# EAGLE schematic Arduino_clone (EAGLE 7.5.0)
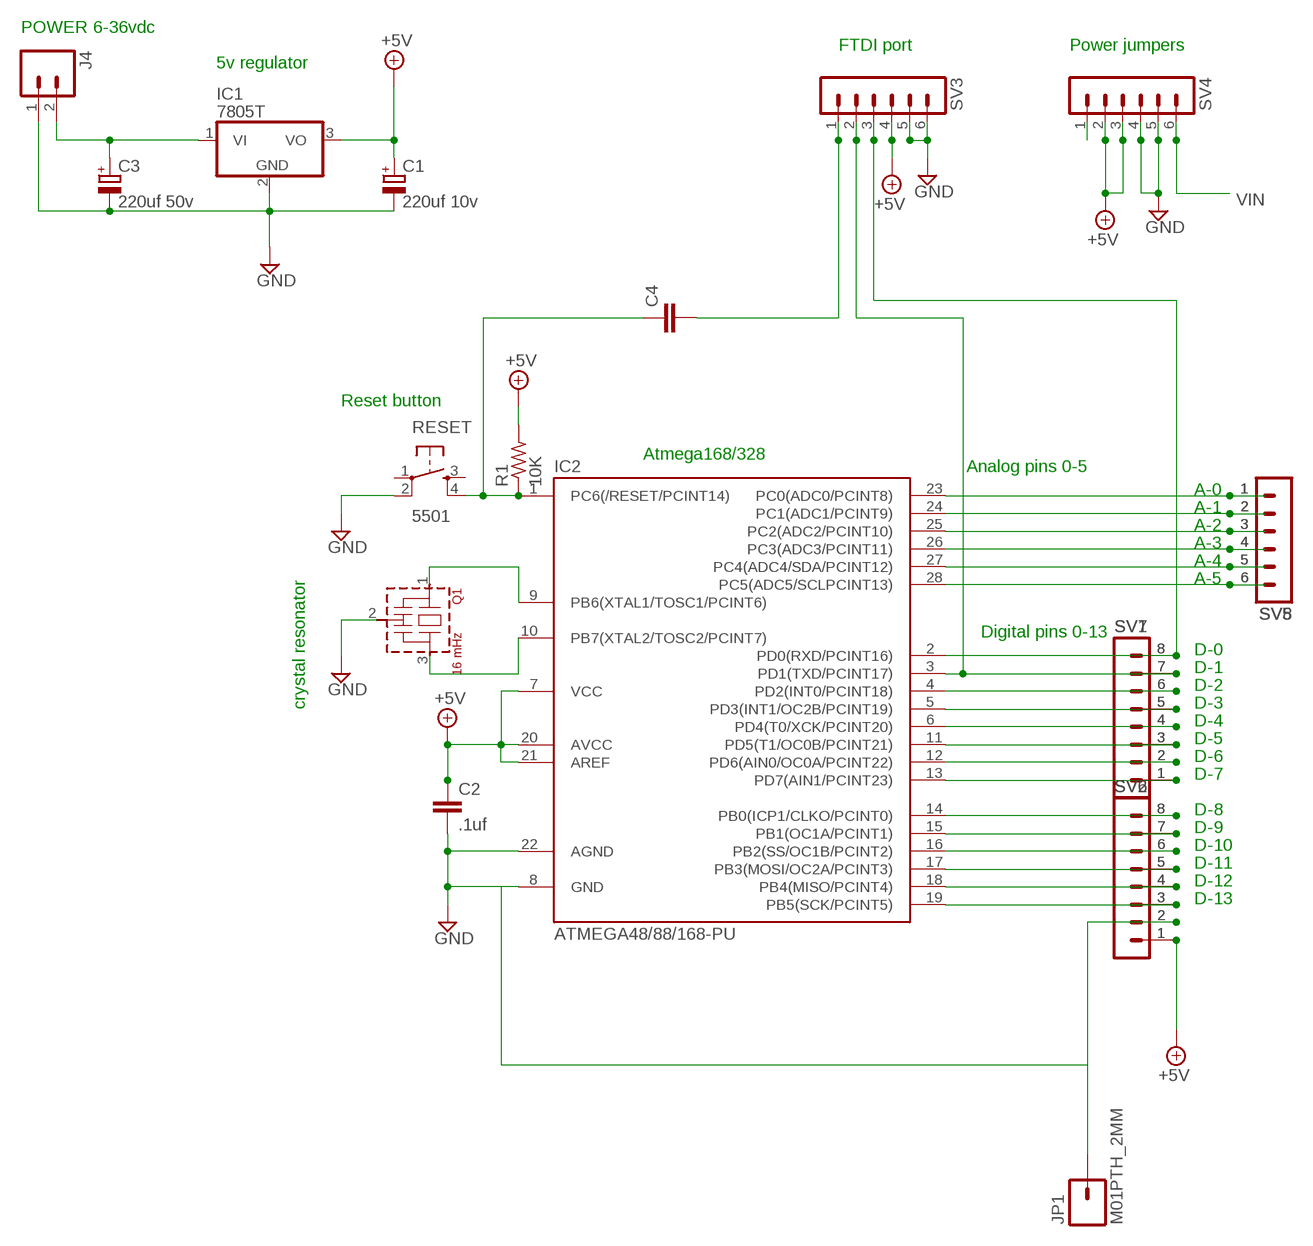
[diagram p0: schematic, sheet 1]

## Parts
C1  220uf 10v  CPOL-EUE2.5-6  [E2,5-6]
C2  .1uf  C-EU050-024X044  [C050-024X044]
C3  220uf 50v  CPOL-EUE2.5-6  [E2,5-6]
C4  C-EU075-032X103  [C075-032X103]
IC1  7805T  [TO220H]
IC2  ATMEGA48/88/168-PU  [DIL28-3]
J4  M02LOCK  [1X02_LOCK]
JP1  M01PTH_2MM  [1X01_2MM]
Q1  16 mHz  CSTLS_X  [CSTLS_X]
R1  10K  R-US_0204/5  [0204/5]
RESET  5501  TAC_SWITCHPTH  [TACTILE-PTH]
SV1  MA08-1  [MA08-1]
SV2  MA08-1  [MA08-1]
SV3  MA06-1  [MA06-1]
SV4  MA06-1  [MA06-1]
SV5  MA06-1  [MA06-1]
SV6  MA08-1  [MA08-1]
SV7  MA08-1  [MA08-1]
SV8  MA06-1  [MA06-1]

## Nets
+5V: C1.+ C2.1 IC1.3(VO) IC2.7(VCC) IC2.20(AVCC) IC2.21(AREF) R1.2 SV2.1 SV3.4 SV4.2 SV4.3 SV6.1
A0: IC2.23(PC0(ADC0/PCINT8)) SV5.1 SV8.1
A1: IC2.24(PC1(ADC1/PCINT9)) SV5.2 SV8.2
A2: IC2.25(PC2(ADC2/PCINT10)) SV5.3 SV8.3
A3: IC2.26(PC3(ADC3/PCINT11)) SV5.4 SV8.4
A4: IC2.27(PC4(ADC4/SDA/PCINT12)) SV5.5 SV8.5
A5: IC2.28(PC5(ADC5/SCLPCINT13)) SV5.6 SV8.6
D0: IC2.2(PD0(RXD/PCINT16)) SV1.8 SV3.3 SV7.8
D1: IC2.3(PD1(TXD/PCINT17)) SV1.7 SV3.2 SV7.7
D2: IC2.4(PD2(INT0/PCINT18)) SV1.6 SV7.6
D3: IC2.5(PD3(INT1/OC2B/PCINT19)) SV1.5 SV7.5
D4: IC2.6(PD4(T0/XCK/PCINT20)) SV1.4 SV7.4
D5: IC2.11(PD5(T1/OC0B/PCINT21)) SV1.3 SV7.3
D6: IC2.12(PD6(AIN0/OC0A/PCINT22)) SV1.2 SV7.2
D7: IC2.13(PD7(AIN1/PCINT23)) SV1.1 SV7.1
D8: IC2.14(PB0(ICP1/CLKO/PCINT0)) SV2.8 SV6.8
D9: IC2.15(PB1(OC1A/PCINT1)) SV2.7 SV6.7
D10: IC2.16(PB2(SS/OC1B/PCINT2)) SV2.6 SV6.6
D11: IC2.17(PB3(MOSI/OC2A/PCINT3)) SV2.5 SV6.5
D12: IC2.18(PB4(MISO/PCINT4)) SV2.4 SV6.4
D13: IC2.19(PB5(SCK/PCINT5)) SV2.3 SV6.3
GND: C1.- C2.2 C3.- IC1.2(GND) IC2.8(GND) IC2.22(AGND) J4.1 JP1.1 Q1.2(VSS) RESET.2 SV2.2 SV3.5 SV3.6 SV4.4 SV4.5 SV6.2
N$1: C4.2 SV3.1
N$3: IC2.10(PB7(XTAL2/TOSC2/PCINT7)) Q1.3
N$5: IC2.9(PB6(XTAL1/TOSC1/PCINT6)) Q1.1
N$6: SV4.1
RESET: C4.1 IC2.1(PC6(/RESET/PCINT14)) R1.1 RESET.4
VIN: C3.+ IC1.1(VI) J4.2 SV4.6
Unconnected: RESET.1 RESET.3

## Notes on the sheet
- POWER 6-36vdc
- FTDI port | Power jumpers
- 5v regulator
- Reset button
- Atmega168/328 | Analog pins 0-5
- A-0
- A-1
- A-2
- A-3
- A-4
- A-5
- Digital pins 0-13
- D-0
- D-1
- D-2
- crystal resonator | D-3
- D-4
- D-5
- D-6
- D-7
- D-8
- D-9
- D-10
- D-11
- D-12
- D-13

## Library data of the parts
C1 C3 = rcl:CPOL-EU: POLARIZED CAPACITOR, European symbol
C2 C4 = rcl:C-EU: CAPACITOR, European symbol
IC1 = linear:78*: Positive VOLTAGE REGULATOR Source: http://cache.national.com/ds/LM/LM78L05.pdf http://www.fairchildsemi.com/ds/LM/LM7805.pdf
IC2 = atmega8:ATMEGA48/88/168-PU
J4 = SparkFun:M02: Header 2 Standard 2-pin 0.1" header. Use with straight break away headers (SKU : PRT-00116), right angle break away headers (PRT-00553), swiss pins (PRT-00743), machine pins (PRT-00117), and female headers (PRT-00115). Molex polarized connector foot print use with SKU : PRT-08233 with associated crimp pins and housings.
JP1 = SparkFun:M01: Header 1 Standard 1-pin 0.1" header. Use with straight break away headers (SKU : PRT-00116), right angle break away headers (PRT-00553), swiss pins (PRT-00743), machine pins (PRT-00117), and female headers (PRT-00115).
Q1 = murata-resonators:CSTLS_X: Ceramic resonator 16.00 to 70.00 MHz
R1 = rcl:R-US_: RESISTOR, American symbol
RESET = SparkFun:TAC_SWITCH: Momentary Switch Button commonly used for reset or general input. Spark Fun Electronics SKU : COM-00097
SV1 SV2 SV6 SV7 = con-lstb:MA08-1: PIN HEADER; OC_FARNELL: unknown; OC_NEWARK: unknown
SV3-SV5 SV8 = con-lstb:MA06-1: PIN HEADER; OC_FARNELL: unknown; OC_NEWARK: unknown